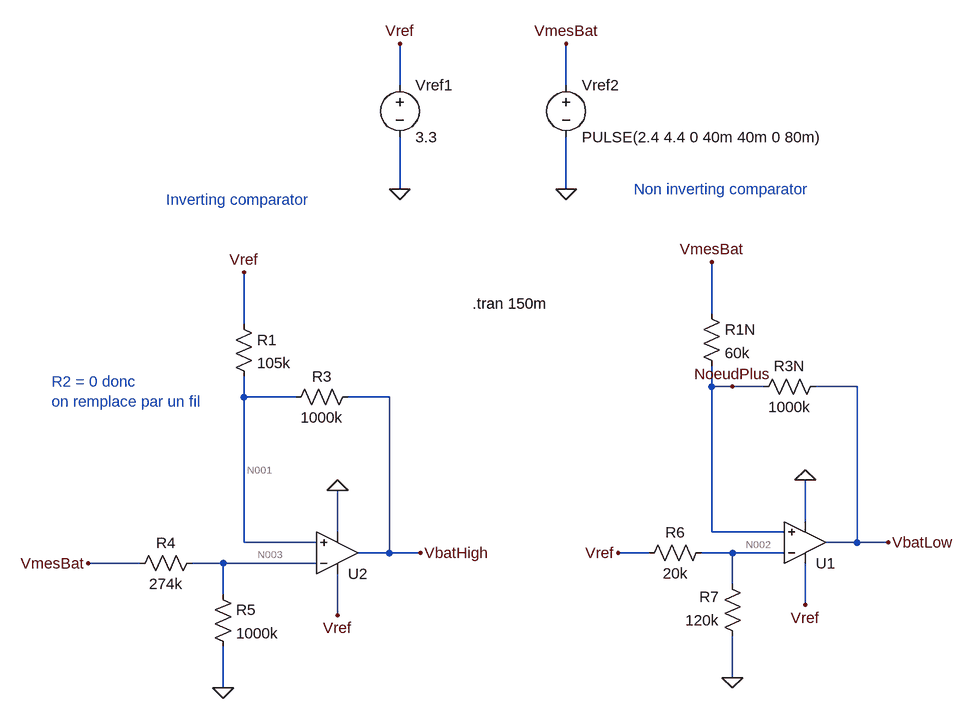
[diagram p0: schematic Ctrl_bat.asc]
Ctrl_bat.asc, the LTspice schematic file:
Version 4.1
SHEET 1 1392 680
WIRE 400 -912 400 -976
WIRE 656 -912 656 -976
WIRE 400 -752 400 -832
WIRE 656 -752 656 -832
WIRE 880 -560 880 -640
WIRE 160 -544 160 -624
WIRE 880 -448 880 -480
WIRE 912 -448 880 -448
WIRE 960 -448 912 -448
WIRE 1104 -448 1040 -448
WIRE 160 -432 160 -464
WIRE 240 -432 160 -432
WIRE 384 -432 320 -432
WIRE 1024 -240 1024 -304
WIRE 304 -224 304 -288
WIRE 880 -224 880 -448
WIRE 992 -224 880 -224
WIRE 160 -208 160 -432
WIRE 272 -208 160 -208
WIRE 1104 -208 1104 -448
WIRE 1104 -208 1056 -208
WIRE 1152 -208 1104 -208
WIRE 384 -192 384 -432
WIRE 384 -192 336 -192
WIRE 432 -192 384 -192
WIRE 784 -192 736 -192
WIRE 912 -192 864 -192
WIRE 992 -192 912 -192
WIRE 0 -176 -80 -176
WIRE 128 -176 80 -176
WIRE 272 -176 128 -176
WIRE 912 -144 912 -192
WIRE 128 -128 128 -176
WIRE 1024 -112 1024 -176
WIRE 304 -96 304 -160
WIRE 912 0 912 -64
WIRE 128 16 128 -48
FLAG 432 -192 VbatHigh
FLAG -80 -176 VmesBat
FLAG 160 -624 Vref
FLAG 304 -288 0
FLAG 304 -96 Vref
FLAG 128 16 0
FLAG 1152 -208 VbatLow
FLAG 736 -192 Vref
FLAG 880 -640 VmesBat
FLAG 1024 -304 0
FLAG 1024 -112 Vref
FLAG 912 -448 NoeudPlus
FLAG 400 -976 Vref
FLAG 400 -752 0
FLAG 656 -976 VmesBat
FLAG 656 -752 0
FLAG 912 0 0
SYMBOL OpAmps\\UniversalOpAmp2 304 -192 M180
SYMATTR InstName U2
SYMBOL res 144 -560 R0
SYMATTR InstName R1
SYMATTR Value 105k
SYMBOL res 336 -448 R90
WINDOW 0 0 56 VBottom 2
WINDOW 3 32 56 VTop 2
SYMATTR InstName R3
SYMATTR Value 1000k
SYMBOL res 96 -192 R90
WINDOW 0 0 56 VBottom 2
WINDOW 3 32 56 VTop 2
SYMATTR InstName R4
SYMATTR Value 274k
SYMBOL res 112 -144 R0
SYMATTR InstName R5
SYMATTR Value 1000k
SYMBOL OpAmps\\UniversalOpAmp2 1024 -208 M180
SYMATTR InstName U1
SYMBOL res 864 -576 R0
SYMATTR InstName R1N
SYMATTR Value 60k
SYMBOL res 1056 -464 R90
WINDOW 0 0 56 VBottom 2
WINDOW 3 32 56 VTop 2
SYMATTR InstName R3N
SYMATTR Value 1000k
SYMBOL voltage 400 -928 R0
WINDOW 123 0 0 Left 0
WINDOW 39 0 0 Left 0
SYMATTR InstName Vref1
SYMATTR Value 3.3
SYMBOL voltage 656 -928 R0
WINDOW 123 0 0 Left 0
WINDOW 39 0 0 Left 0
SYMATTR InstName Vref2
SYMATTR Value PULSE(2.4 4.4 0 40m 40m 0 80m)
SYMBOL res 880 -208 R90
WINDOW 0 0 56 VBottom 2
WINDOW 3 32 56 VTop 2
SYMATTR InstName R6
SYMATTR Value 20k
SYMBOL res 928 -48 R180
WINDOW 0 36 76 Left 2
WINDOW 3 36 40 Left 2
SYMATTR InstName R7
SYMATTR Value 120k
TEXT 40 -736 Left 2 ;Inverting comparator
TEXT 760 -752 Left 2 ;Non inverting comparator
TEXT 512 -576 Left 2 !.tran 150m
TEXT -136 -456 Left 2 ;R2 = 0 donc \non remplace par un fil

The netlist it stands for:
* Ctrl_bat.asc
X§U2 N001 N003 Vref 0 VbatHigh level2 Avol=1Meg GBW=10Meg Slew=10Meg Ilimit=25m Rail=0 Vos=0 En=0 Enk=0 In=0 Ink=0 Rin=500Meg  ; pins In+ In- V+ V- OUT
R1 Vref N001 105k
R3 VbatHigh N001 1000k
R4 N003 VmesBat 274k
R5 N003 0 1000k
X§U1 NoeudPlus N002 Vref 0 VbatLow level2 Avol=1Meg GBW=10Meg Slew=10Meg Ilimit=25m Rail=0 Vos=0 En=0 Enk=0 In=0 Ink=0 Rin=500Meg  ; pins In+ In- V+ V- OUT
R1N VmesBat NoeudPlus 60k
R3N VbatLow NoeudPlus 1000k
Vref1 Vref 0 3.3
Vref2 VmesBat 0 PULSE(2.4 4.4 0 40m 40m 0 80m)
R6 N002 Vref 20k
R7 0 N002 120k
* Inverting comparator
* Non inverting comparator
.tran 150m
* R2 = 0 donc
* on remplace par un fil
.lib UniversalOpAmp2.lib
.backanno
.end

* Results of the author's LTspice run, read from the files saved beside the schematic
* Operating Point, zero values left out:
*   V(n003) = 1.884 V
*   V(vbathigh) = 3.3 V
*   V(vmesbat) = 2.4 V
*   V(n002) = 2.829 V
*   V(n001) = 3.3 V
*   V(vref) = 3.3 V
*   V(noeudplus) = 2.264 V
*   V(vbatlow) = 26.99 µV
*   I(R5) = 1.884 µA
*   I(R1N) = 2.265 µA
*   I(Vref1) = -24.28 µA
*   I(R6) = -23.57 µA
*   I(R7) = -23.57 µA
*   I(R1) = 2.989 nA
*   I(R3) = 310.3 pA
*   I(R4) = -1.884 µA
*   I(R3N) = -2.264 µA
*   I(Vref2) = -4.149 µA
*   Ix(u1:1) = 1.228 nA
*   Ix(u1:2) = 2.357 nA
*   Ix(u1:3) = 422.4 nA
*   Ix(u1:4) = -2.548 µA
*   Ix(u1:5) = 2.264 µA
*   Ix(u2:1) = 3.299 nA
*   Ix(u2:2) = 467.5 pA
*   Ix(u2:3) = 280.9 nA
*   Ix(u2:4) = -426.1 nA
*   Ix(u2:5) = -310.3 pA
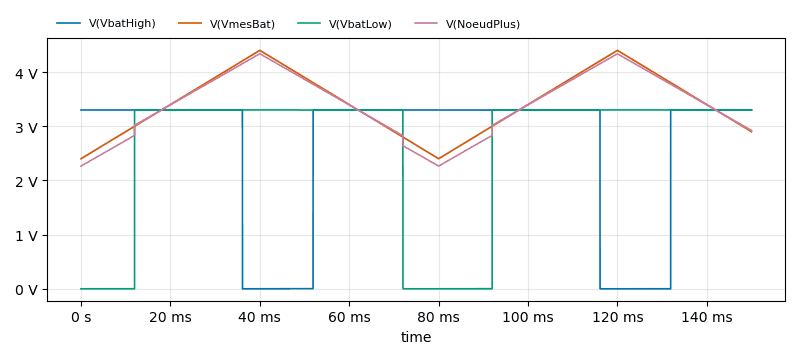
[diagram p1: Transient Analysis of Ctrl_bat.asc, plotted from the saved traces]
* Transient Analysis, 1 run:
*   V(VbatHigh): min 10.01 µV, max 3.3 V, average 2.605 V, rms 2.932 V, last 3.3 V
*   V(VmesBat): min 2.4 V, max 4.4 V, average 3.45 V, rms 3.496 V, last 2.9 V
*   V(VbatLow): min 8.437 µV, max 3.3 V, average 2.597 V, rms 2.927 V, last 3.3 V
*   V(NoeudPlus): min 2.264 V, max 4.337 V, average 3.402 V, rms 3.452 V, last 2.922 V